# Altium schematic sheet TopBoard.SchDoc: Top Board
size A4; SheetNumber: 1; SheetTotal: 6
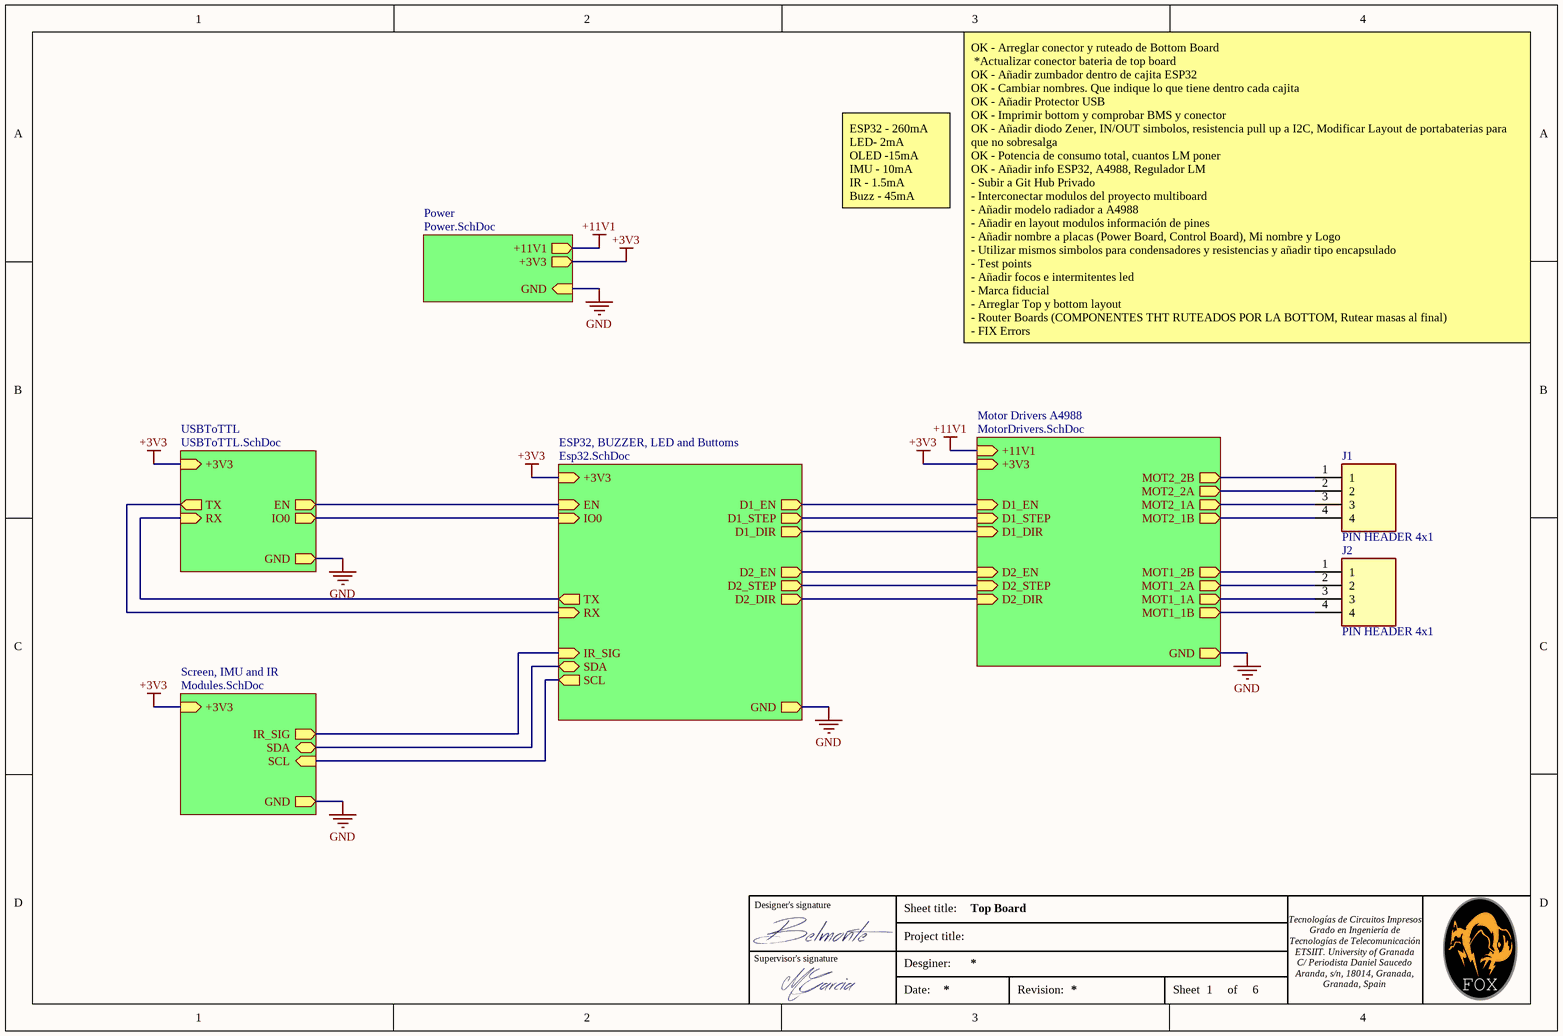
[diagram p0: TopBoard.SchDoc]

## Parts
J1  PIN HEADER 4x1  [HDRV4W50P0X200_1X4_800X200X525P]
J2  PIN HEADER 4x1  [HDRV4W50P0X200_1X4_800X200X525P]

## Sub-sheets
ESP32, BUZZER, LED and Buttoms = Esp32.SchDoc: +3V3 (in), GND (out), EN (in), D2_DIR (out), D2_EN (out), D1_STEP (out), SDA (bidir), D1_DIR (out), D1_EN (out), TX (out), D2_STEP (out), IO0 (in), RX (in), IR_SIG (in), SCL (out)
Motor Drivers A4988 = MotorDrivers.SchDoc: D1_EN (in), D2_EN (in), MOT1_2A (out), MOT1_2B (out), MOT2_1B (out), D2_STEP (in), MOT2_2A (out), +3V3 (in), D1_DIR (in), D2_DIR (in), MOT1_1A (out), MOT2_1A (out), GND (out), +11V1 (in), MOT1_1B (out), MOT2_2B (out), D1_STEP (in)
Power = Power.SchDoc: +11V1 (out), +3V3 (out), GND (in)
Screen, IMU and IR = Modules.SchDoc: GND (out), +3V3 (in), IR_SIG (out), SDA (bidir), SCL (in)
USBToTTL = USBToTTL.SchDoc: EN (out), GND (out), RX (in), TX (out), IO0 (out), +3V3 (in)

## Nets
+3V3: sheet ESP32, BUZZER, LED and Buttoms/+3V3, sheet USBToTTL/+3V3, sheet Motor Drivers A4988/+3V3, sheet Power/+3V3, sheet Screen, IMU and IR/+3V3
+11V1: sheet Motor Drivers A4988/+11V1, sheet Power/+11V1
GND: sheet ESP32, BUZZER, LED and Buttoms/GND, sheet USBToTTL/GND, sheet Motor Drivers A4988/GND, sheet Power/GND, sheet Screen, IMU and IR/GND
NetJ1_1: J1.1 ; sheet Motor Drivers A4988/MOT2_2B
NetJ1_2: J1.2 ; sheet Motor Drivers A4988/MOT2_2A
NetJ1_3: J1.3 ; sheet Motor Drivers A4988/MOT2_1A
NetJ1_4: J1.4 ; sheet Motor Drivers A4988/MOT2_1B
NetJ2_1: J2.1 ; sheet Motor Drivers A4988/MOT1_2B
NetJ2_2: J2.2 ; sheet Motor Drivers A4988/MOT1_2A
NetJ2_3: J2.3 ; sheet Motor Drivers A4988/MOT1_1A
NetJ2_4: J2.4 ; sheet Motor Drivers A4988/MOT1_1B
(unnamed): sheet ESP32, BUZZER, LED and Buttoms/EN, sheet USBToTTL/EN
(unnamed): sheet ESP32, BUZZER, LED and Buttoms/D2_DIR, sheet Motor Drivers A4988/D2_DIR
(unnamed): sheet ESP32, BUZZER, LED and Buttoms/D2_EN, sheet Motor Drivers A4988/D2_EN
(unnamed): sheet ESP32, BUZZER, LED and Buttoms/D1_STEP, sheet Motor Drivers A4988/D1_STEP
(unnamed): sheet ESP32, BUZZER, LED and Buttoms/SDA, sheet Screen, IMU and IR/SDA
(unnamed): sheet ESP32, BUZZER, LED and Buttoms/D1_DIR, sheet Motor Drivers A4988/D1_DIR
(unnamed): sheet ESP32, BUZZER, LED and Buttoms/D1_EN, sheet Motor Drivers A4988/D1_EN
(unnamed): sheet ESP32, BUZZER, LED and Buttoms/TX, sheet USBToTTL/RX
(unnamed): sheet ESP32, BUZZER, LED and Buttoms/D2_STEP, sheet Motor Drivers A4988/D2_STEP
(unnamed): sheet ESP32, BUZZER, LED and Buttoms/IO0, sheet USBToTTL/IO0
(unnamed): sheet ESP32, BUZZER, LED and Buttoms/RX, sheet USBToTTL/TX
(unnamed): sheet ESP32, BUZZER, LED and Buttoms/IR_SIG, sheet Screen, IMU and IR/IR_SIG
(unnamed): sheet ESP32, BUZZER, LED and Buttoms/SCL, sheet Screen, IMU and IR/SCL

## Notes on the sheet
- ESP32 - 260mA
  LED- 2mA
  OLED -15mA
  IMU - 10mA
  IR - 1.5mA
  Buzz - 45mA
- OK - Arreglar conector y ruteado de Bottom Board
  *Actualizar conector bateria de top board
  OK - Añadir zumbador dentro de cajita ESP32
  OK - Cambiar nombres. Que indique lo que tiene dentro cada cajita
  OK - Añadir Protector USB
  OK - Imprimir bottom y comprobar BMS y conector
  OK - Añadir diodo Zener, IN/OUT simbolos, resistencia pull up a I2C, Modificar Layout de portabaterias para que no sobresalga
  OK - Potencia de consumo total, cuantos LM poner
  OK - Añadir info ESP32, A4988, Regulador LM
  - Subir a Git Hub Privado
  - Interconectar modulos del proyecto multiboard
  - Añadir modelo radiador a A4988
  - Añadir en layout modulos información de pines
  - Añadir nombre a placas (Power Board, Control Board), Mi nombre y Logo
  - Utilizar mismos simbolos para condensadores y resistencias y añadir tipo encapsulado
  - Test points
  - Añadir focos e intermitentes led
  - Marca fiducial
  - Arreglar Top y bottom layout
  - Router Boards (COMPONENTES THT RUTEADOS POR LA BOTTOM, Rutear masas al final)
  - FIX Errors
- Designer's signature
- Sheet title:
- Supervisor's signature
- Project title:
- Desginer:
- Tecnologías de Circuitos Impresos
  Grado en Ingeniería de Tecnologías de Telecomunicación
  ETSIIT. University of Granada
  C/ Periodista Daniel Saucedo Aranda, s/n, 18014, Granada, Granada, Spain
- Date:
- Revision:
- Sheet
- of

## Library data of the parts
J1 J2 = M22-2510405: Connector; Manufacturer_Name: Harwin; Datasheet Link: https://cdn.harwin.com/pdfs/M22-251.pdf; Height: 5.25mm; Manufacturer_Part_Number: M22-2510405; Mouser Part Number: 855-M22-2510405; Mouser Price/Stock: https://www.mouser.co.uk/ProductDetail/Harwin/M22-2510405?qs=vF78I%252BjhbY9z7PsFZBZ5CA%3D%3D